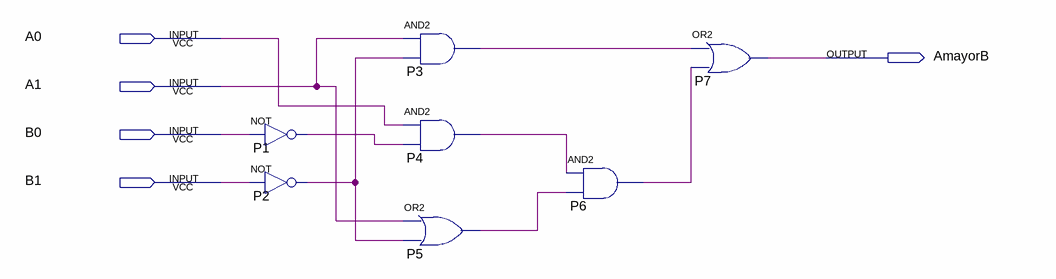
[diagram p0: schematic sheet]
// Quartus schematic Comparador.bdf as structural Verilog: 7 symbols, 5 pins
module Comparador (
  input  A0,
  input  A1,
  input  B0,
  input  B1,
  output AmayorB
);

  wire P1_out, P2_out, P3_out, P4_out, P5_out, P6_out;

  not P1 (P1_out, B0);
  not P2 (P2_out, B1);
  and P3 (P3_out, A1, P2_out);
  and P4 (P4_out, A0, P1_out);
  or P5 (P5_out, A1, P2_out);
  and P6 (P6_out, P4_out, P5_out);
  or P7 (AmayorB, P3_out, P6_out);
endmodule
